# Altium schematic sheet Raspberry_Pi_4_ModelB.SchDoc
size Tabloid; Date: Date; Author: Author 1; DocumentNumber: 7; Revision: 1; SheetNumber: 7; SheetTotal: 7; Size: 11x17; Sheet_Name: Raspberry_Pi; SPICEModelCacheRTYEHROU: <root> / <DocumentId>RTYEHROU</DocumentId> / </root>
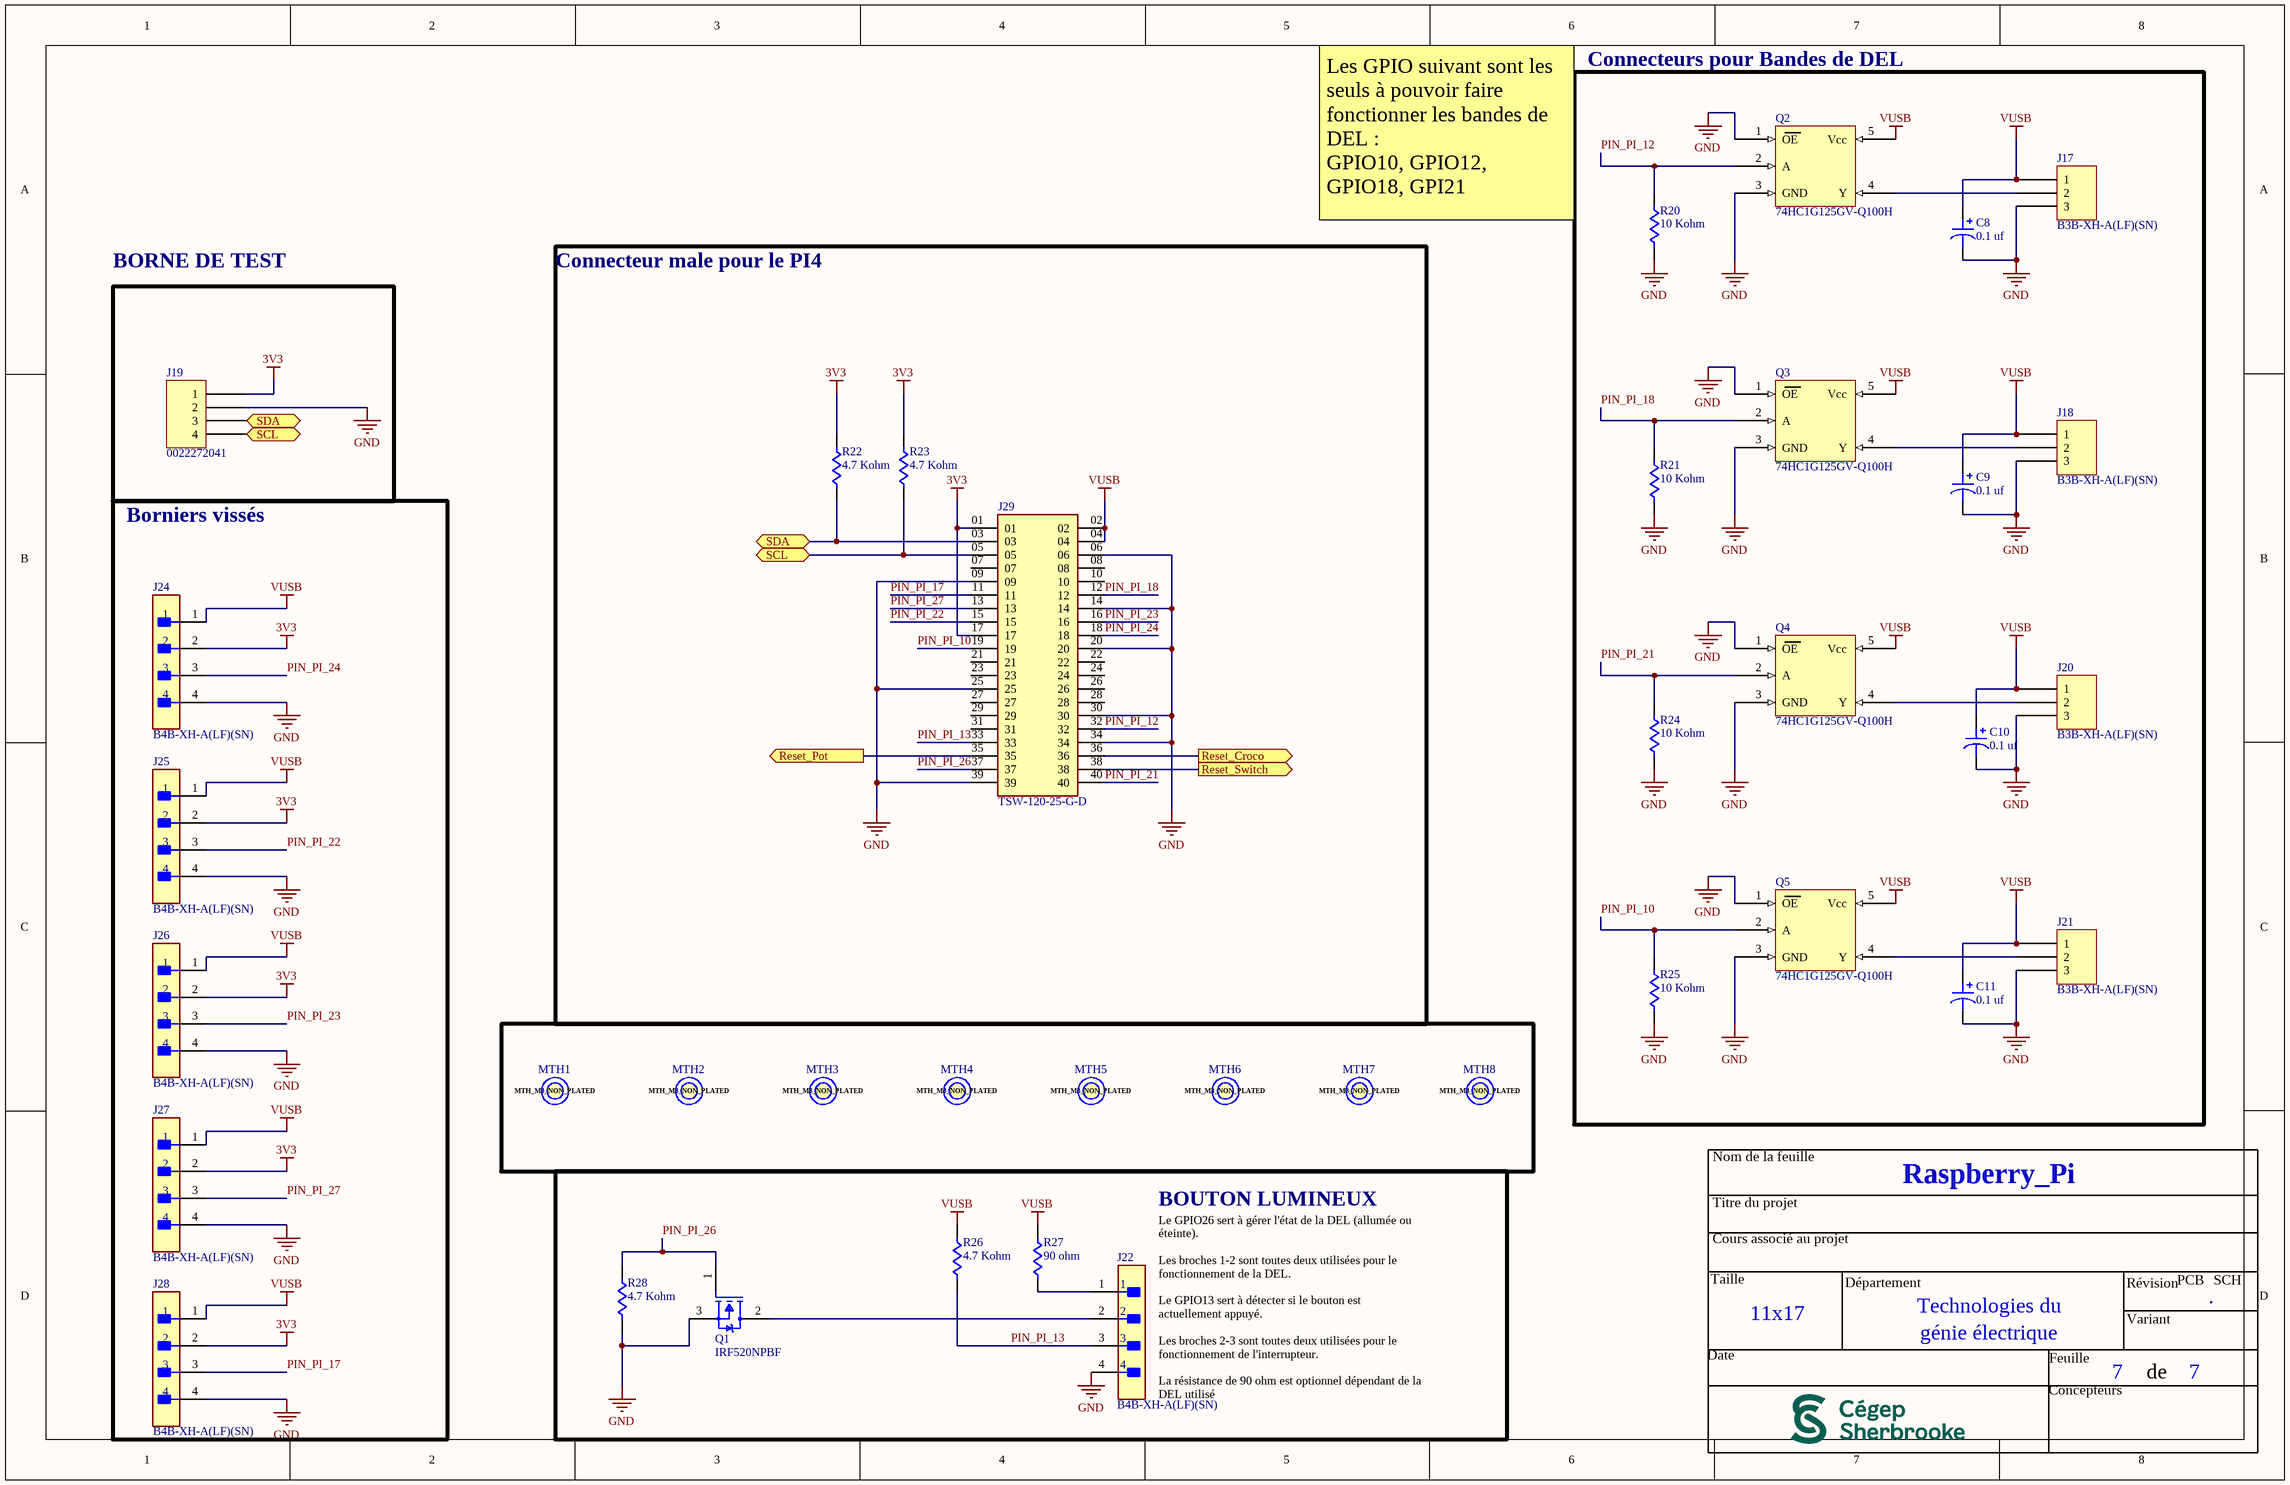
[diagram p0: Raspberry_Pi_4_ModelB.SchDoc]

## Parts
C8  0.1 uf  [CAP TH ALPOLY D8.00mm S3.50mm H21.50mm]
C9  0.1 uf  [CAP TH ALPOLY D8.00mm S3.50mm H21.50mm]
C10  0.1 uf  [CAP TH ALPOLY D8.00mm S3.50mm H21.50mm]
C11  0.1 uf  [CAP TH ALPOLY D8.00mm S3.50mm H21.50mm]
J17  B3B-XH-A(LF)(SN)  [JST XH B3B-XH-A]
J18  B3B-XH-A(LF)(SN)  [JST XH B3B-XH-A]
J19  0022272041  [MOLEX KK 0022272041]
J20  B3B-XH-A(LF)(SN)  [JST XH B3B-XH-A]
J21  B3B-XH-A(LF)(SN)  [JST XH B3B-XH-A]
J22  B4B-XH-A(LF)(SN)  [FP-B4B-XH-A_LF_SN-MFG]
J24  B4B-XH-A(LF)(SN)  [FP-B4B-XH-A_LF_SN-MFG]
J25  B4B-XH-A(LF)(SN)  [FP-B4B-XH-A_LF_SN-MFG]
J26  B4B-XH-A(LF)(SN)  [FP-B4B-XH-A_LF_SN-MFG]
J27  B4B-XH-A(LF)(SN)  [FP-B4B-XH-A_LF_SN-MFG]
J28  B4B-XH-A(LF)(SN)  [FP-B4B-XH-A_LF_SN-MFG]
J29  TSW-120-25-G-D  [SAMTEC_TSW-120-25-G-D]
MTH1  MTH_M3_NON_PLATED  [MTH_M3_NON_PLATED]  (no BOM)
MTH2  MTH_M3_NON_PLATED  [MTH_M3_NON_PLATED]  (no BOM)
MTH3  MTH_M3_NON_PLATED  [MTH_M3_NON_PLATED]  (no BOM)
MTH4  MTH_M3_NON_PLATED  [MTH_M3_NON_PLATED]  (no BOM)
MTH5  MTH_M3_NON_PLATED  [MTH_M3_NON_PLATED]  (no BOM)
MTH6  MTH_M3_NON_PLATED  [MTH_M3_NON_PLATED]  (no BOM)
MTH7  MTH_M3_NON_PLATED  [MTH_M3_NON_PLATED]  (no BOM)
MTH8  MTH_M3_NON_PLATED  [MTH_M3_NON_PLATED]  (no BOM)
Q1  IRF520NPBF  [FP-PG-TO220-3-MFG]
Q2  74HC1G125GV-Q100H  [SOT95P275X110-5N]
Q3  74HC1G125GV-Q100H  [SOT95P275X110-5N]
Q4  74HC1G125GV-Q100H  [SOT95P275X110-5N]
Q5  74HC1G125GV-Q100H  [SOT95P275X110-5N]
R20  10 Kohm  [Res_Template]
R21  10 Kohm  [Res_Template]
R22  4.7 Kohm  [Res_Template]
R23  4.7 Kohm  [Res_Template]
R24  10 Kohm  [Res_Template]
R25  10 Kohm  [Res_Template]
R26  4.7 Kohm  [Res_Template]
R27  90 ohm  [Res_Template]
R28  4.7 Kohm  [Res_Template]

## Blocks framed on the sheet
Connecteurs pour Bandes de DEL: C8-C11 J17 J18 J20 J21 Q2-Q5 R20 R21 R24 R25
Connecteur male pour le PI4: J29 R22 R23
BORNE DE TEST: J19
Borniers vissés: J24-J28
BOUTON LUMINEUX: J22 Q1 R26-R28

## Ports
Reset_Croco (out), Reset_Pot (out), Reset_Switch (out), SCL (bidir), SDA (bidir)

## Nets
3V3: J19.1 J24.2 J25.2 J26.2 J27.2 J28.2 J29.01 J29.17 R22.2 R23.1
GND: C8.2 C9.2 C10.2 C11.2 J17.3 J18.3 J19.2 J20.3 J21.3 J22.4 J24.4 J25.4 J26.4 J27.4 J28.4 J29.06 J29.09 J29.14 J29.20 J29.25 J29.30 J29.34 J29.39 Q1.3(S) Q2.1(OE) Q2.3(GND) Q3.1(OE) Q3.3(GND) Q4.1(OE) Q4.3(GND) Q5.1(OE) Q5.3(GND) R20.1 R21.1 R24.1 R25.1 R28.1
VUSB: C8.1 C9.1 C10.1 C11.1 J17.1 J18.1 J20.1 J21.1 J24.1 J25.1 J26.1 J27.1 J28.1 J29.02 J29.04 Q2.5(Vcc) Q3.5(Vcc) Q4.5(Vcc) Q5.5(Vcc) R26.2 R27.2
PIN_PI_10: J29.19 Q5.2(A) R25.2
PIN_PI_12: J29.32 Q2.2(A) R20.2
PIN_PI_13: J22.3 J29.33 R26.1
PIN_PI_17: J28.3 J29.11
PIN_PI_18: J29.12 Q3.2(A) R21.2
PIN_PI_21: J29.40 Q4.2(A) R24.2
PIN_PI_22: J25.3 J29.15
PIN_PI_23: J26.3 J29.16
PIN_PI_24: J24.3 J29.18
PIN_PI_26: J29.37 Q1.1(G) R28.2
PIN_PI_27: J27.3 J29.13
Reset_Croco: J29.36 ; port Reset_Croco
Reset_Pot: J29.35 ; port Reset_Pot
Reset_Switch: J29.38 ; port Reset_Switch
SCL: J19.4 J29.05 R23.2 ; port SCL
SDA: J19.3 J29.03 R22.1 ; port SDA
NetJ17_2: J17.2 Q2.4(Y)
NetJ18_2: J18.2 Q3.4(Y)
NetJ20_2: J20.2 Q4.4(Y)
NetJ21_2: J21.2 Q5.4(Y)
NetJ22_1: J22.1 R27.1
NetJ22_2: J22.2 Q1.2(D)

Not connected (* = marked no-connect by the designer): J29 07 08 10 21 22 23 24 26 27 28 29 31

## Notes on the sheet
- Les GPIO suivant sont les seuls à pouvoir faire fonctionner les bandes de DEL :
  GPIO10, GPIO12, GPIO18, GPI21
- (near J22) Le GPIO26 sert à gérer l'état de la DEL (allumée ou éteinte).
  Les broches 1-2 sont toutes deux utilisées pour le fonctionnement de la DEL.
  Le GPIO13 sert à détecter si le bouton est actuellement appuyé.
  Les broches 2-3 sont toutes deux utilisées pour le fonctionnement de l'interrupteur.
  La résistance de 90 ohm est optionnel dépendant de la DEL utilisé
- Nom de la feuille
- Titre du projet
- Cours associé au projet
- Taille
- Département
- Technologies du
- Révision
- PCB
- .
- SCH
- Date
- génie électrique
- Feuille
- Variant
- de
- Concepteurs

## Library data of the parts
C8-C11 = APSG160ELL152MH20S: ALUMINUM CAPACITOR; manufacturer: Chemi-Con; Capacitance: 1.5 mF; ESR (Equivalent Series Resistance): 8mOhm; Lifetime @ Temp.: 20000 Hrs @ 105°C; Ripple Current @ High Frequency: 7.5 A @ 100 kHz; Ripple Current @ Low Frequency: 750 mA @ 120 Hz; Tolerance: ±20%; Type: Polymer; Voltage - Rated: 16 V; Part Number: APSG160ELL152MH20S; Value: 0.1 uf; Applications: General Purpose; componentlink1description: Datasheet; componentlink1url: https://www.chemi-con.co.jp/products/relatedfiles/capacitor/catalog/PSGLL-e.PDF; componentlink2description: DigiKey Link; componentlink2url: https://www.digikey.com/en/products/detail/chemi-con/APSG160ELL152MH20S/21805209; Height - Seated (Max): 0.846" (21.50mm); lastupdated: 2024-06-03 20:25:13; Lead Spacing: 0.138" (3.50mm); Lifecycle Status: Active; Minimum Order: 1; Mounting Type: Through Hole; Operating Temperature: -55°C ~ 105°C; packaging: Bulk; partid: 5888; price: 0.35; series: NPCAP™-PSG; Size / Dimension: 0.315" Dia (8.00mm); Supplier 1: DigiKey; Supplier Part Number 1: 565-APSG160ELL152MH20S-ND
J17 J18 J20 J21 = B3B-XH-A(LF)(SN): CONN HEADER VERT 3POS 2.5MM; Manufacturer: JST Sales America Inc.; Contact Length - Post: 0.134" (3.40mm); Current Rating (Amps): 3A; Material Flammability Rating: UL94 V-0; Number of Positions: 3; Number of Positions Loaded: All; Pitch - Mating: 0.098" (2.50mm); Shrouding: Shrouded - 4 Wall; Style: Board to Cable/Wire; Voltage Rating: 250V; Part Number: B3B-XH-A(LF)(SN); ComponentLink1Description: Datasheet; ComponentLink1URL: http://www.jst-mfg.com/product/pdf/eng/eXH.pdf; ComponentLink2Description: DigiKey Link; ComponentLink2URL: http://digikey.com/product-detail/en/jst-sales-america-inc/B3B-XH-A-LF-SN/455-2248-ND/1651046; Connector Type: Header; Contact Finish - Mating: Tin; Contact Finish - Post: Tin; Contact Material: Brass; Contact Shape: Square; Contact Type: Male Pin; Fastening Type: Detent Lock; Insulation Color: Natural; Insulation Height: 0.276" (7.00mm); Insulation Material: Polyamide (PA66), Nylon 6/6; LastUpdated: 2020-01-12 23:46:22; Lifecycle Status: Active; Minimum Order: 1; Mounting Type: Through Hole; Number of Rows: 1; Operating Temperature: -25°C ~ 85°C; Packaging: Bulk; PartId: 68; Part Status: Active; Price: 0.19; Series: XH; Supplier 1: DigiKey; Supplier Part Number 1: 455-2248-ND; Termination: Press-Fit, Solder
J19 = 0022272041: CONN HEADER VERT 4POS 2.54MM; Part Number: 0022272041
J22 J24-J28 = CMP-17439-000250-1: CONN HEADER VERT 4POS 2.5MM; Number of Contacts: 4; Contact Resistance: 20mR; Voltage Rating: 250V; Max Current Rating: 3A; Gender: Male; Wire/Cable Gauge: 22AWG; Mated Stacking Heights: 9.8mm; Insulation Resistance: 1GR; Orientation: Straight; Contact Type: Male Pin; Contact Finish - Mating: TIN; Series: XH; Max Voltage Rating (AC): 250V; Lead Pitch: 2.5mm; Contact Shape: Square; Insulation Color: Natural; Termination: Solder; Lead Free: Lead Free; Voltage Rating (AC): 250V; Number of Rows: 1; Flammability Rating: UL94 V-0; Number of Positions: 4; Max Operating Temperature: 85°C; Package Quantity: 500; Mount: Through Hole; REACH SVHC: No SVHC; Connector Type: Header; Insulation Material: Nylon; Fastening Type: Detent; Min Operating Temperature: -25°C; Housing Color: White; Packaging: Bulk; Contact Plating: Tin; Contact Material: Brass; Max Voltage Rating (DC): 250V; Housing Material: Polyamide; Color: Natural; Material: Polyamide; Pitch: 2.5mm; Depth: 5.75mm; Current Rating: 3A; Length: 12.4mm
MTH1-MTH8 = CMP-006-000010-2: MTH - MOUNTING HOLE M3 NON-PLATED - M3; Value: *; Component Type: Standard (No BOM); Package: M3; HelpURL: https://littlemachineshop.com/images/gallery/PDF/TapDrillSizes.pdf; Polarized: *; Pin Count: 0; Note: *; Assembly Type: NONE; Part Number #1: *; Source: CEGEP_SHERBROOKE_TGE_LIBRARY.SchLib; Design Item ID: MTH_M3_NON_PLATED; Power Max: *; Manufacturer #1: *
Q1 = CMP-32901-000276-1: MOSFET N-CH 100V 9.7A TO-220AB; Max Power Dissipation: 48W; Drain to Source Resistance: 200mR; Input Capacitance: 330pF; Gate to Source Voltage (Vgs): 20V; Element Configuration: Single; Threshold Voltage: 4V; Rise Time: 23ns; Turn-On Delay Time: 4.5ns; Turn-Off Delay Time: 32ns; Case/Package: TO-220; Power Dissipation: 48W; Drain to Source Voltage (Vdss): 100V; Continuous Drain Current (ID): 9.7A; Width: 0.185inch; Packaging: Rail/Tube; Mount: Through Hole; Max Operating Temperature: 175°C; Rds On Max: 200mR; Number of Pins: 3; Drain to Source Breakdown Voltage: 100V; Lead Free: Lead Free; Contact Plating: Tin; Height: 0.6inch; Min Operating Temperature: -55°C; RoHS Compliant: Yes; Length: 0.414inch; REACH SVHC: No SVHC; Halogen Free: Halogen Free; Max Dual Supply Voltage: 100V
Q2-Q5 = 74HC1G125GV-Q100H NXP Semiconductors: Bus Driver, HC/UH Series, 1-Func, 1-Bit, True Output, CMOS, PDSO5; Supply Voltage-Max: 6V; Supply Voltage-Min: 2V; Supply Voltage-Nominal: 5V; ComponentLink1Description: New link; ComponentLink1URL: https://www.snapeda.com/parts/74HC1G125GV-Q100H/Nexperia/view-part/?welcome=home&ref=octopart; Surface Mount: Yes
R20-R28 = 470 ohm: Custom Semiconductor Resistor
J29 = TSW-120-25-G-D: Package: None; Price: None; Value: *; MP: TSW-120-25-G-D; Availability: Unavailable